# EAGLE schematic coqui-v1.0 (EAGLE 7.1.0)
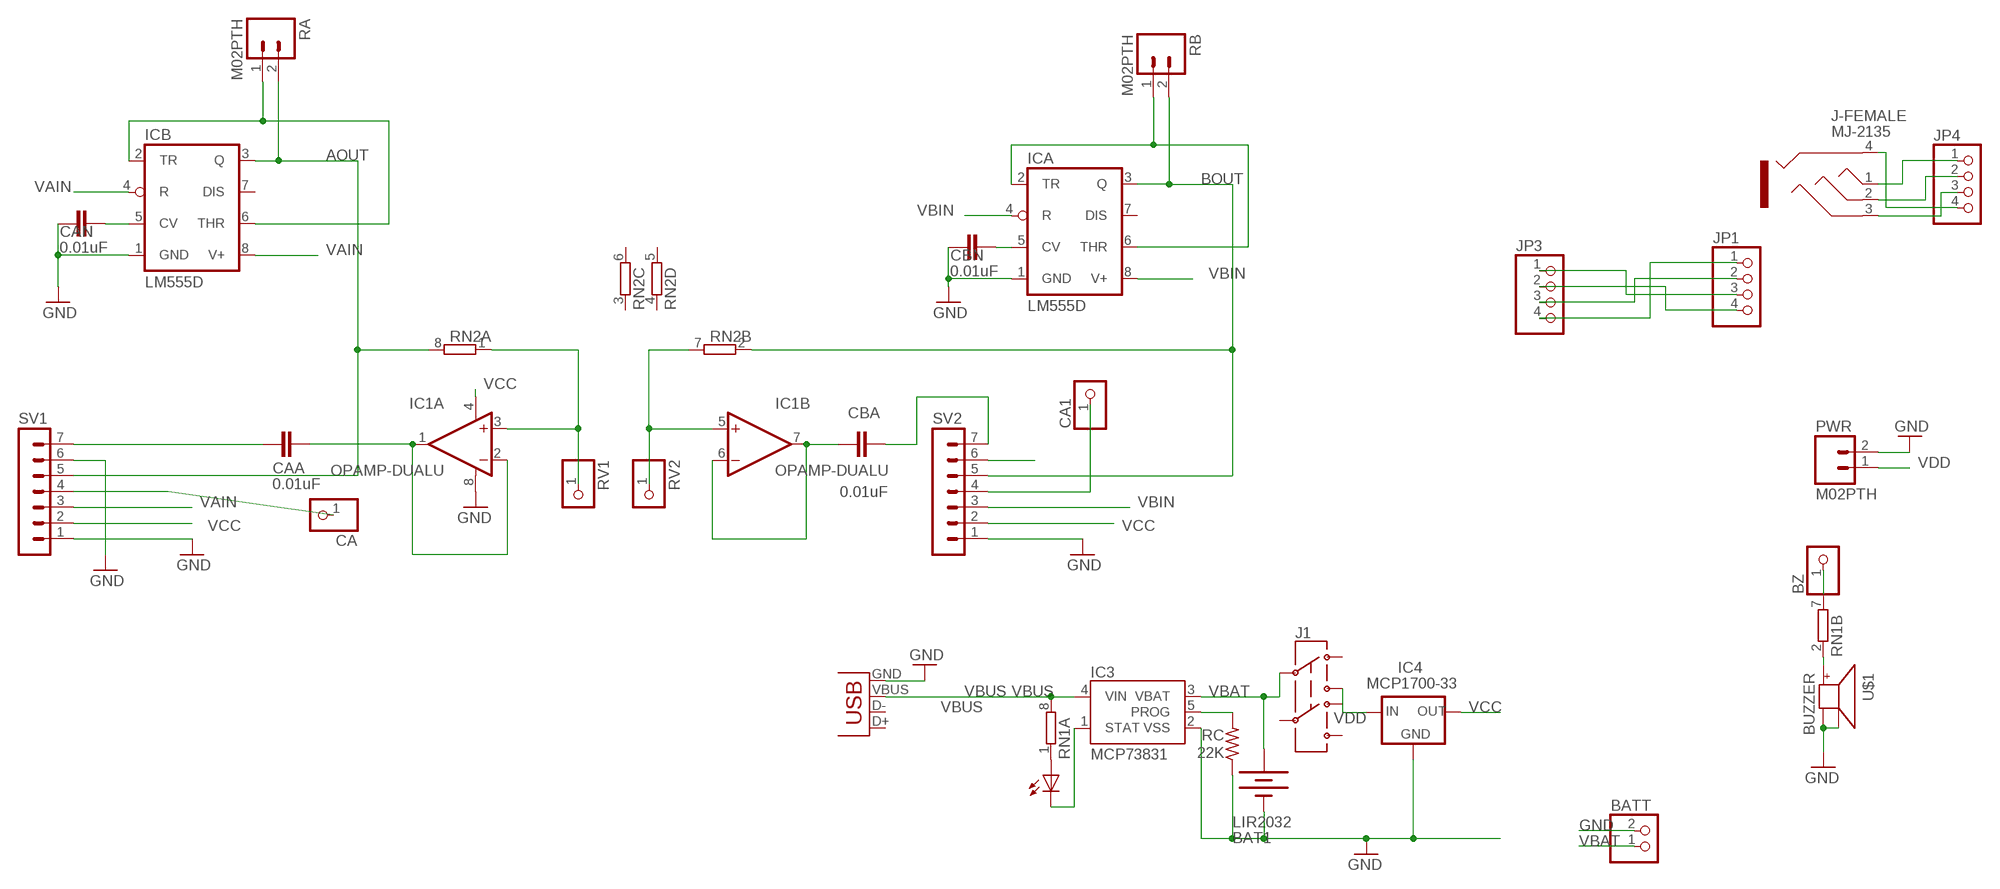
[diagram p0: schematic, sheet 1]

## Parts
BAT1  LIR2032  BATTERYBATTCOM_20MM_PTH_SMT  [BATTCOM_20MM_PTH_SMT]
BATT  JST_2PIN-SMT-RA  [JST-PH-2-SMT-RA]
BZ  PINHD-1X1  [1X01]
CA  PINHD-1X1  [1X01]
CA1  PINHD-1X1  [1X01]
CAA  0.01uF  C-EUC0805  [C0805@1]
CAN  0.01uF  C-EUC0805  [C0805@1]
CBA  0.01uF  C-EUC0805  [C0805@1]
CBN  0.01uF  C-EUC0805  [C0805@1]
CHG  0805  LEDCHIPLED_0805  [CHIPLED_0805]
IC1  OPAMP-DUALU  [SO08]
IC3  MCP73831  [SOT23-5]
IC4  MCP1700-33  MCP1700SOT89  [SOT89]
ICA  LM555D  [SO08]
ICB  LM555D  [SO08]
J1  AYZ0202  [AYZ0202]
J-FEMALE  MJ-2135  [MJ-2135]
JP1  PINHD-1X4/90  [1X04/90]
JP3  PINHD-1X4  [1X04]
JP4  PINHD-1X4  [1X04]
PWR  M02PTH  [1X02]
RA  M02PTH  [1X02]
RB  M02PTH  [1X02]
RC  22K  R-US_R0805  [R0805]
RN1  4R-NEXB38V  [EXB38V]
RN2  4R-NEXB38V  [EXB38V]
RV1  PINHD-1X1  [1X01]
RV2  PINHD-1X1  [1X01]
SV1  MA07-1  [MA07-1]
SV2  MA07-1  [MA07-1]
U$1  BUZZER  [SMT-8585-BUZZER]
X1  USBSMD  [USB-MINIB]

## Nets
AOUT: ICB.3(Q) RA.2 RN2.8 SV1.5
BOUT: ICA.3(Q) RB.2 RN2.2 SV2.5
GND: BAT1.P$1(-) BATT.2 CAN.1 CBN.1 IC1.8(A:V+) IC3.2(VSS) IC4.1(GND) ICA.1(GND) ICB.1(GND) PWR.2 RC.1 SV1.1 U$1.- U$1.A- X1.GND
N$1: J-FEMALE.1 JP4.1
N$2: J-FEMALE.2 JP4.2
N$3: IC3.5(PROG) RC.2
N$4: J-FEMALE.3 JP4.3
N$5: CHG.C IC3.1(STAT)
N$6: J-FEMALE.4 JP4.4
N$7: BZ.1 RN1.7
N$8: CHG.A RN1.1
N$9: CAA.1 SV1.7
N$10: CAA.2 IC1.1(A:OUT) IC1.2(A:-IN)
N$11: ICB.2(TR) ICB.6(THR) RA.1
N$12: RN1.2 U$1.+
N$13: CBA.2 SV2.7
N$14: CAN.2 ICB.5(CV)
N$15: CBN.2 ICA.5(CV)
N$16: ICA.2(TR) ICA.6(THR) RB.1
N$17: SV1.6 ; supply symbol labelled GND
N$18: JP1.1 JP3.4
N$19: JP1.3 JP3.1
N$20: JP1.2 JP3.3
N$21: JP1.4 JP3.2
N$23: IC1.3(A:+IN) IC1.5(B:+IN) RN2.1 RN2.7 RV1.1
N$24: CBA.1 IC1.6(B:-IN) IC1.7(B:OUT)
N$25: CA.1 SV1.4
N$26: SV2.6
N$27: CA1.1 SV2.4
VAIN: ICB.4(R) ICB.8(V+) SV1.3
VBAT [power]: BAT1.P$2(+) BATT.1 IC3.3(VBAT) J1.2
VBIN: ICA.4(R) ICA.8(V+)
VBUS [power]: IC3.4(VIN) RN1.8 X1.VBUS
VCC: IC1.4(A:V-) IC4.3(OUT) SV1.2
VDD: IC4.2(IN) J1.1 PWR.1
Unconnected: ICA.7(DIS) ICB.7(DIS) J1.3 J1.4 J1.5 J1.6 RN1.3 RN1.4 RN1.5 RN1.6 RN2.3 RN2.4 RN2.5 RN2.6 RV2.1 SV2.1 SV2.2 SV2.3 X1.D+ X1.D-

## Library data of the parts
BAT1 = SparkFunNew:BATTERY: Battery Holders Various common sizes : AA, AAA, 20mm coin cell and 12mm coin cell.
BATT = adafruit:JST_2PIN: JST 2-Pin Connectors of various flavors SMT-RA (S2B-PH-SM4) 4UConnector #17311 SMT (B2B-PH-SM4) THM-RA (S2B-PH) THM (B2B-PH)
BZ CA CA1 RV1 RV2 = pinhead:PINHD-1X1: PIN HEADER
CAA CAN CBA CBN = rcl:C-EU: CAPACITOR, European symbol
CHG = led:LED: LED OSRAM: - CHIPLED LG R971, LG N971, LY N971, LG Q971, LY Q971, LO R971, LY R971 LH N974, LH R974 LS Q976, LO Q976, LY Q976 LO Q996 - Hyper CHIPLED LW Q18S LB Q993, LB Q99A, LB R99A - SideLED LS A670, LO A670, LY A670, LG A670, LP A670 LB A673, LV A673, LT A673, LW A673 LH A674 LY A675 LS A676, LA A676, LO A676, LY A676, LW A676 LS A679, LY A679, LG A679 - Hyper Micro SIDELED® LS Y876, LA Y876, LO Y876, LY Y876 LT Y87S - SmartLED LW L88C, LW L88S LB L89C, LB L89S, LG L890 LS L89K, LO L89K, LY L89K LS L896, LA L896, LO L896, LY L896 - TOPLED LS T670, LO T670, LY T670, LG T670, LP T670 LSG T670, LSP T670, LSY T670, LOP T670, LYG T670 LG T671, LOG T671, LSG T671 LB T673, LV T673, LT T673, LW T673 LH T674 LS T676, LA T676, LO T676, LY T676, LB T676, LH T676, LSB T676, LW T676 LB T67C, LV T67C, LT T67C, LS T67K, LO T67K, LY T67K, LW E67C LS E67B, LA E67B, LO E67B, LY E67B, LB E67C, LV E67C, LT E67C LW T67C LS T679, LY T679, LG T679 LS T770, LO T770, LY T770, LG T770, LP T770 LB T773, LV T773, LT T773, LW T773 LH T774 LS E675, LA E675, LY E675, LS T675 LS T776, LA T776, LO T776, LY T776, LB T776 LHGB T686 LT T68C, LB T68C - Hyper Mini TOPLED® LB M676 - Mini TOPLED Santana® LG M470 LS M47K, LO M47K, LY M47K Source: http://www.osram.convergy.de LUXEON: - LUMILED® LXK2-PW12-R00, LXK2-PW12-S00, LXK2-PW14-U00, LXK2-PW14-V00 LXK2-PM12-R00, LXK2-PM12-S00, LXK2-PM14-U00 LXK2-PE12-Q00, LXK2-PE12-R00, LXK2-PE12-S00, LXK2-PE14-T00, LXK2-PE14-U00 LXK2-PB12-K00, LXK2-PB12-L00, LXK2-PB12-M00, LXK2-PB14-N00, LXK2-PB14-P00, LXK2-PB14-Q00 LXK2-PR12-L00, LXK2-PR12-M00, LXK2-PR14-Q00, LXK2-PR14-R00 LXK2-PD12-Q00, LXK2-PD12-R00, LXK2-PD12-S00 LXK2-PH12-R00, LXK2-PH12-S00 LXK2-PL12-P00, LXK2-PL12-Q00, LXK2-PL12-R00 Source: www.luxeon.com KINGBRIGHT: KA-3528ASYC Source: www.kingbright.com
IC1 = SparkFun-AnalogIC:OPAMP-DUAL: Generic op-amp footprint
IC3 = SparkFunNew:MCP73831: Microchip's MCP73831 Miniature single cell, fully integrated Li-Ion, Li-polymer charge management controller http://ww1.microchip.com/downloads/en/DeviceDoc/21984a.pdf
IC4 = adafruit:MCP1700: VOLTAGE REGULATOR
ICA ICB = adafruit:*555: TIMER Changed DIP package to have round (not oval) pin pads http://www.ladyada.net/library/pcb/eaglelibrary.html
J1 = SparkFunNew:AYZ0202: SPDT Slide Switch Simple SMD single-pull double-throw slide switch. Good for less than 350mA power switch, switching UARTs between devices, etc. Spark Fun Electronics SKU : COM-00597
J-FEMALE = iPhoneSoftModem:MJ-2135
JP1 = trrs-dwb:PINHD-1X4: PIN HEADER
JP3 JP4 = pinhead:PINHD-1X4: PIN HEADER
PWR RA RB = SparkFun-Connectors:M02: Standard 2-pin 0.1" header. Use with - straight break away headers ( PRT-00116) - right angle break away headers (PRT-00553) - swiss pins (PRT-00743) - machine pins (PRT-00117) - female headers (PRT-00115) Molex polarized connector foot print use with: PRT-08233 with associated crimp pins and housings. 2.54_SCREWTERM for use with PRT-10571. 3.5mm Screw Terminal footprints for PRT-08084 5mm Screw Terminal footprints for use with PRT-08432
RC = adafruit2013:R-US_: RESISTOR, American symbol
RN1 RN2 = resistor-dil:4R-N: Array Chip Resistor Source: RS Component / Phycomp; OC_FARNELL: unknown; OC_NEWARK: unknown
SV1 SV2 = con-lstb:MA07-1: PIN HEADER; OC_FARNELL: unknown; OC_NEWARK: unknown
U$1 = adafruit:BUZZER
X1 = SparkFun:USB: USB Connectors USB-B-PTH is fully proven SKU : PRT-00139 USB-miniB is fully proven SKU : PRT-00587 USB-A-PCB is untested. USB-A-H is throughly reviewed, but untested. Spark Fun Electronics SKU : PRT-00437 USB-B-SMT is throughly reviewed, but untested. Needs silkscreen touching up. USB-A-S has not been used/tested USB-MB-H has not been used/tested

## Net classes
0 default: width 0.254 mm, clearance 0.203 mm
1 power: width 0.254 mm, clearance 0.178 mm